# Altium schematic sheet MCMainSch.SchDoc
size A
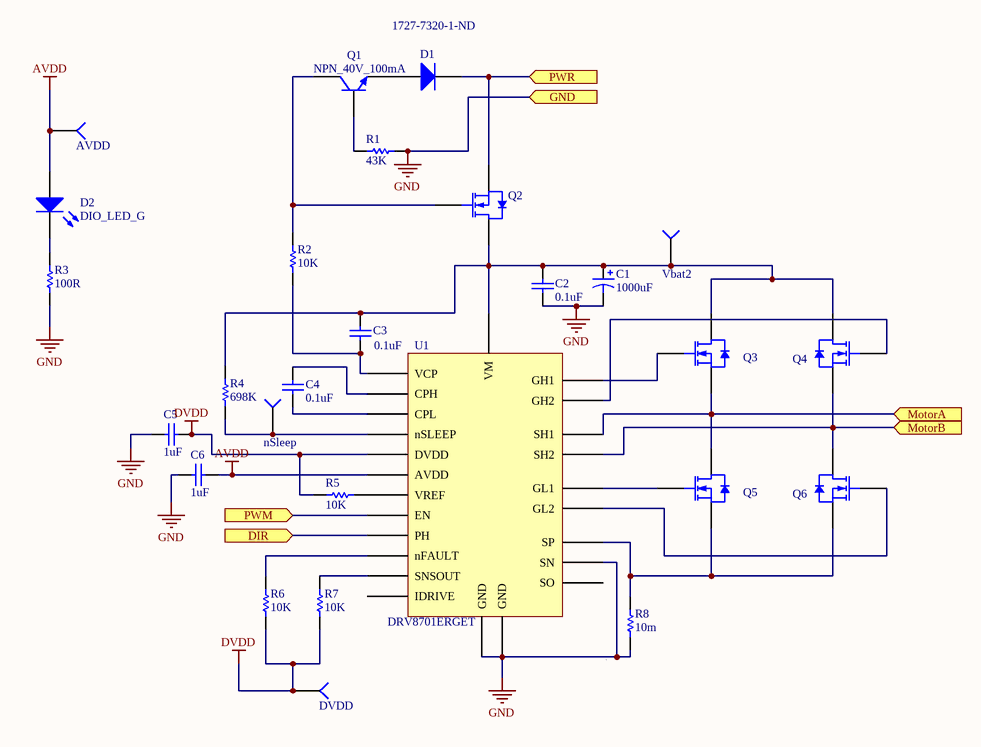
[diagram p0: MCMainSch.SchDoc]

## Parts
C1  value 1000uF  [CAPR-2/4h6.8]  (hidden comment: CAP_22uF_POL)
C2  value 0.1uF  [CAPC0603(1608)55_N]  (hidden comment: CAP_0.1uF_16V_0603)
C3  value 0.1uF  [CAPC0603(1608)55_N]  (hidden comment: CAP_0.1uF_16V_0603)
C4  value 0.1uF  [CAPC0603(1608)55_N]  (hidden comment: CAP_0.1uF_16V_0603)
C5  value 1uF  [CAPC0603(1608)55_N]  (hidden comment: CAP_1uF_16V_0603)
C6  value 1uF  [CAPC0603(1608)55_N]  (hidden comment: CAP_1uF_16V_0603)
D1  Supplier Part Number 1: 1727-7320-1-ND  [DIODSOD-123]  (hidden comment: 0)
D2  DIO_LED_G  [LED_0805_LINE]
Q1  NPN_40V_100mA  [SOT23-3]
Q2  NMOS_40V_75A  [SOT404]  (value not drawn)
Q3  NMOS_40V_75A  [SOT404]  (value not drawn)
Q4  NMOS_40V_75A  [SOT404]  (value not drawn)
Q5  NMOS_40V_75A  [SOT404]  (value not drawn)
Q6  NMOS_40V_75A  [SOT404]  (value not drawn)
R1  value 43K  [RESC0603(1608)_N]  (hidden comment: RES_43K_0603)
R2  value 10K  [RESC0603(1608)_N]  (hidden comment: RES_10K_0603)
R3  value 100R  [RESC0603(1608)_N]  (hidden comment: RES_0R_0603)
R4  value 698K  [RESC0603(1608)_N]  (hidden comment: RES_698K_0603)
R5  value 10K  [RESC0603(1608)_N]  (hidden comment: RES_10K_0603)
R6  value 10K  [RESC0603(1608)_N]  (hidden comment: RES_10K_0603)
R7  value 10K  [RESC0603(1608)_N]  (hidden comment: RES_10K_0603)
R8  value 10m  [STAC-CSS2725-099H_V]  (hidden comment: RES_10m_2728)
TP1  AVDD  [TESTPOINT]
TP2  Vbat2  [TESTPOINT]
TP3  nSleep  [TESTPOINT]
TP4  DVDD  [TESTPOINT]
U1  DRV8701ERGET  [VFQFPN-24_N]

## Ports
DIR (in), GND (in), MotorA (in), MotorB (in), PWM (in), PWR (in)

## Nets
AVDD: C6.2 D2.1(A) TP1.1(=value) U1.6(AVDD)
DVDD: C5.2 R5.1 R6.1 R7.1 TP4.1(=value) U1.5(DVDD)
GND: C1.2 C2.1 C5.1 C6.1 R1.1 R3.1 R8.1 U1.13(GND) U1.14(GND) U1.22(SN) ; port GND
DIR: U1.9(PH) ; port DIR
MotorA: Q3.3(S) Q5.4(D) U1.17(SH1) ; port MotorA
MotorB: Q4.3(S) Q6.4(D) U1.18(SH2) ; port MotorB
PWM: U1.8(EN) ; port PWM
PWR: D1.2(K) Q2.3(S) ; port PWR
NetC1_1: C1.1 C2.2 C3.2 Q2.4(D) Q3.4(D) Q4.4(D) R4.2 TP2.1(=value) U1.24(VM)
NetC3_1: C3.1 R2.1 U1.1(VCP)
NetC4_1: C4.1 U1.3(CPL)
NetC4_2: C4.2 U1.2(CPH)
NetD1_1: D1.1(A) Q1.2(E)
NetD2_2: D2.2(K) R3.2
NetQ1_1: Q1.1(B) R1.2
NetQ1_3: Q1.3(C) Q2.1(G) R2.2
NetQ3_1: Q3.1(G) U1.15(GH1)
NetQ4_1: Q4.1(G) U1.16(GH2)
NetQ5_1: Q5.1(G) U1.19(GL1)
NetQ5_3: Q5.3(S) Q6.3(S) R8.2 U1.21(SP)
NetQ6_1: Q6.1(G) U1.20(GL2)
NetR4_1: R4.1 TP3.1(=value) U1.4(nSLEEP)
NetR5_2: R5.2 U1.7(VREF)
NetR6_2: R6.2 U1.10(nFAULT)
NetR7_2: R7.2 U1.11(SNSOUT)

Not connected (* = marked no-connect by the designer): U1 12(IDRIVE) 23(SO) 25(GND)

## Library data of the parts
C1 = CAP_22uF_POL: CAP ALUM 22UF 20% 50V RADIAL; Manufacturer: Wurth Electronics Inc.; MPN: 860020672011; Voltage Rating: 50V; Tolerance: 20%; Digikey Part Number: 732-8857-1-ND
C2-C4 = CAP_0.1uF_16V_0603: CAP CER 0.1UF 16V X7R 0603; MPN: CC0603KRX7R7BB104; Manufacturer: Yageo; Dimensions: 0.063" L x 0.031" W (1.60mm x 0.80mm); Package: 0603 (1608 Metric); Temperature Coefficient: X7R; Voltage Rating: 16V; Digikey Part Number: 311-1088-1-ND
C5 C6 = CAP_1uF_16V_0603: CAP CER 1UF 16V Y5V 0603; MPN: CC0603ZRY5V7BB105; Manufacturer: Yageo; Dimensions: 0.063" L x 0.031" W (1.60mm x 0.80mm); Package: 0603 (1608 Metric); Temperature Coefficient: Y5V; Voltage Rating: 16V; Digikey Part Number: 311-1372-1-ND
D1 = DIO_BAS16GW: ESD PROTECTION DIODE; Manufacturer: Nexperia; Package: SOD-123; MPN: BAS16GW; ComponentLink1Description: Datasheet; ComponentLink1URL: https://assets.nexperia.com/documents/data-sheet/BAS16GW.pdf; Digikey Part Number: 1727-7320-1-ND; Supplier 1: Digi-Key
D2 = DIO_LED_G: LED GREEN DIFFUSED 0805 SMD; MPN: LG R971-KN-1; Manufacturer: OSRAM; Forward Voltage Drop: 2.2V; Package: 0805 (2012 Metric); Digikey Part Number: 475-1410-1-ND
Q1 = NPN_40V_100mA: TRANS NPN 40V 0.2A SOT23; Manufacturer: Micro Commercial Co; MPN: MMBT3904-TP; Package: TO-236-3, SC-59, SOT-23-3; ComponentLink1Description: Datasheet; ComponentLink1URL: http://www.mccsemi.com/up_pdf/MMBT3904(SOT-23).pdf; Digikey Part Number: MMBT3904TPMSCT-ND
Q2-Q6 = NMOS_40V_75A: MOSFET N-CH 40V 75A D2PAK; MPN: BUK768R1-40E,118; Manufacturer: Nexperia USA Inc.; Package: TO-263-3, D²Pak (2 Leads + Tab), TO-263AB; ComponentLink1Description: Datasheet; ComponentLink1URL: http://aosmd.com/res/data_sheets/AO3420.pdf; Digikey Part Number: 1727-7257-1-ND; Supplier 1: Digi-Key; Supplier Part Number 1: 1727-7255-1-ND
R1 = RES_43K_0603: RES SMD 43K OHM 5% 1/10W 0603; Manufacturer: Yageo; MPN: RC0603JR-0743KL; Package: 0603 (1608 Metric); Dimensions: 0.063" L x 0.031" W (1.60mm x 0.80mm); Tolerance: 5%; Digikey Part Number: 311-43KGRCT-ND
R2 R5-R7 = RES_10K_0603: RES SMD 10K OHM 5% 1/10W 0603; Manufacturer: Yageo; MPN: RC0603JR-0710KL; Package: 0603 (1608 Metric); Dimensions: 0.063" L x 0.031" W (1.60mm x 0.80mm); Tolerance: 5%; Digikey Part Number: 311-10KGRCT-ND
R3 = RES_0R_0603: RES SMD 0 OHM JUMPER 1/10W 0603; Manufacturer: Yageo; MPN: RC0603JR-070RL; Package: 0603 (1608 Metric); Dimensions: 0.063" L x 0.031" W (1.60mm x 0.80mm); Digikey Part Number: 311-0.0GRCT-ND
R4 = RES_698K_0603: RES SMD 698K OHM 1% 1/10W 0603; Manufacturer: Yageo; MPN: RC0603FR-07698KL; Package: 0603 (1608 Metric); Dimensions: 0.063" L x 0.031" W (1.60mm x 0.80mm); Tolerance: 1%; Digikey Part Number: 311-698KHRCT-ND
R8 = RES_10m_2728: RES SMD 10mOHM 1% 4W 2728; Manufacturer: Yageo; MPN: RC0603FR-07698KL; Package: 0603 (1608 Metric); Dimensions: 0.063" L x 0.031" W (1.60mm x 0.80mm); Tolerance: 1%; Supplier 1: Digi-Key; Digikey Part Number: CSSH2728FT10L0DKR-ND
TP1-TP4 = *: TESTPOINT_SMD; Part Number (MPN): *
U1 = IC Motor Driver: Manufacturer: Texas Instruments; Interface: Parallel; Supplier 1: Digi-Key; Manufacturer Part Number: DRV8701ERGET; Stock 1: 17098; Pricing 1: 1=2.83, 10=2.541, 100=2.0425 (USD); Mount: Surface Mount; Case/Package: VQFN; Min Operating Temperature: -40°C; Max Operating Temperature: 125°C; Packaging: Tape and Reel; Lead Free: Lead Free; Supplier Part Number 1: 296-42155-1-ND